# Altium schematic sheet UP-Buzzer-Schematic.SchDoc
size A
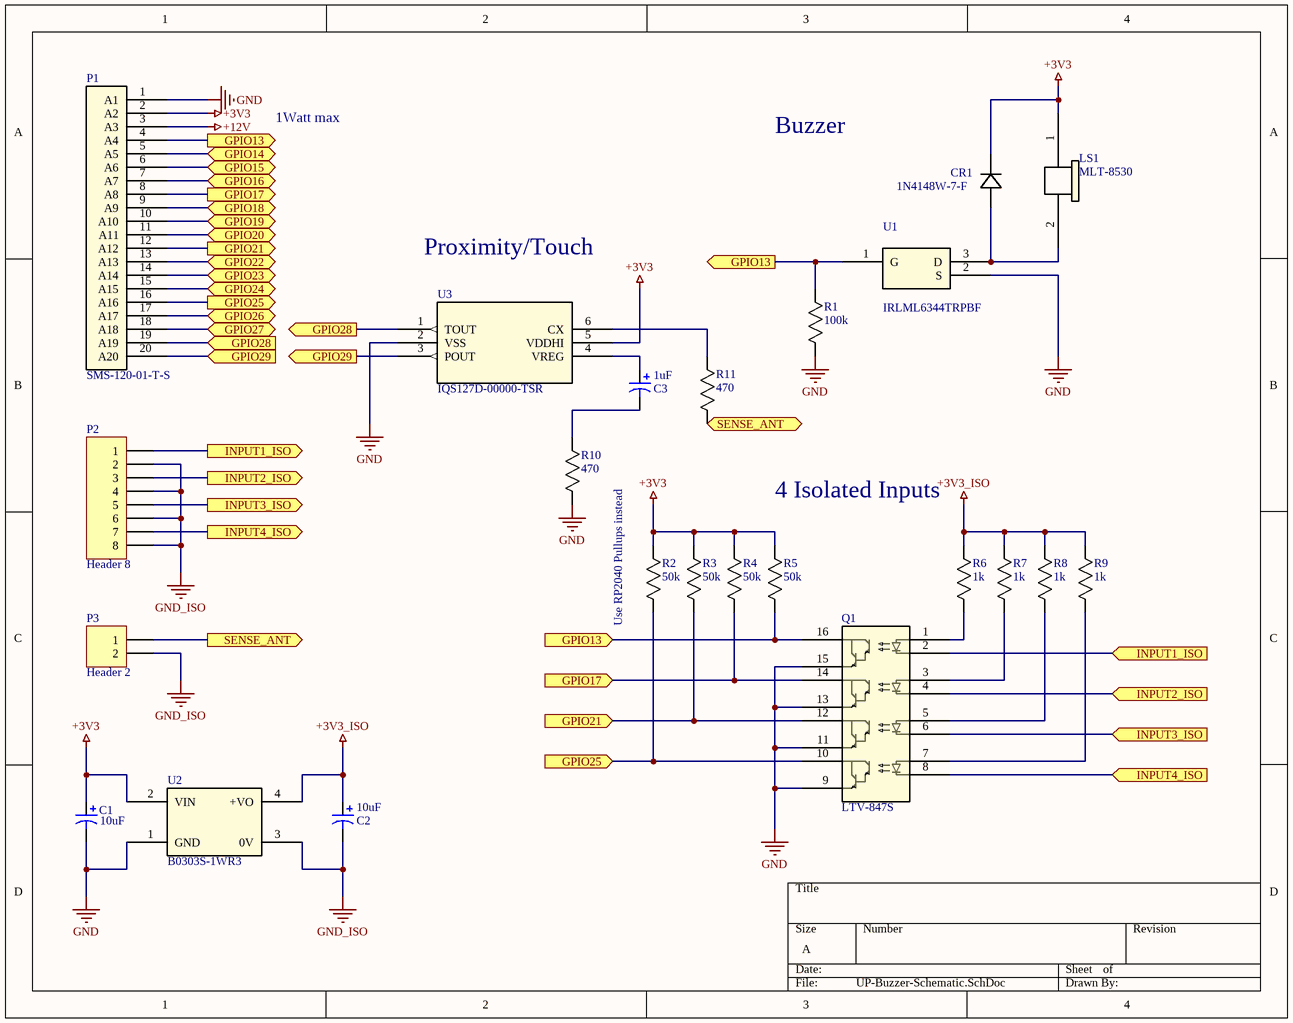
[diagram p0: UP-Buzzer-Schematic.SchDoc]

## Parts
C1  value 10uF  [C0805]
C2  value 10uF  [C0805]  (hidden comment: Cap Pol3)
C3  value 1uF  [C0805]  (hidden comment: Cap Pol3)
CR1  1N4148W-7-F  [SOD123_DIO]
LS1  MLT-8530  [MLT-8530_JHE]
P1  SMS-120-01-T-S  [SMS-S-120]
P2  Header 8  [HDR1X8]
P3  Header 2  [HDR1X2]
Q1  LTV-847S  [LTV-847S_LTO]
R1  100k  [RC0603N_YAG]
R2  50k  [RC0603N_YAG]
R3  50k  [RC0603N_YAG]
R4  50k  [RC0603N_YAG]
R5  50k  [RC0603N_YAG]
R6  1k  [RC0603N_YAG]
R7  1k  [RC0603N_YAG]
R8  1k  [RC0603N_YAG]
R9  1k  [RC0603N_YAG]
R10  470  [RC0603N_YAG]
R11  470  [RC0603N_YAG]
U1  IRLML6344TRPBF  [IRLML6344TRPBF_INF]
U2  B0303S-1WR3  [SIP4_B_S-1WR3_MNS]
U3  IQS127D-00000-TSR  [TSOT23-6_AZQ]

## Ports
GPIO13 (in), GPIO13 (out), GPIO14 (bidir), GPIO15, GPIO16, GPIO17 (in), GPIO17 (out), GPIO18, GPIO19, GPIO20, GPIO21 (in), GPIO21 (out), GPIO22, GPIO23, GPIO24, GPIO25 (in), GPIO25 (out), GPIO26 (bidir), GPIO27 (bidir), GPIO28 (in), GPIO28 (out), GPIO29 (in), GPIO29 (out), INPUT1_ISO (in), INPUT1_ISO (out), INPUT2_ISO (in), INPUT2_ISO (out), INPUT3_ISO (in), INPUT3_ISO (out), INPUT4_ISO (in), INPUT4_ISO (out), SENSE_ANT (in), SENSE_ANT (out)

## Nets
+3V3: C1.1 CR1.1 LS1.1 P1.2(A2) R2.2 R3.2 R4.2 R5.2 U2.2(VIN) U3.5(VDDHI)
+3V3_ISO: C2.1 R6.2 R7.2 R8.2 R9.2 U2.4(+VO)
+12V: P1.3(A3)
GND: C1.2 P1.1(A1) Q1.9 Q1.11 Q1.13 Q1.15 R1.1 R10.1 U1.2(S) U2.1(GND) U3.2(VSS)
GND_ISO: C2.2 P2.2 P2.4 P2.6 P2.8 P3.2 U2.3(0V)
GPIO13: P1.4(A4) Q1.16 R1.2 R5.1 U1.1(G) ; port GPIO13
GPIO14: P1.5(A5) ; port GPIO14
GPIO15: P1.6(A6) ; port GPIO15
GPIO16: P1.7(A7) ; port GPIO16
GPIO17: P1.8(A8) Q1.14 R4.1 ; port GPIO17
GPIO18: P1.9(A9) ; port GPIO18
GPIO19: P1.10(A10) ; port GPIO19
GPIO20: P1.11(A11) ; port GPIO20
GPIO21: P1.12(A12) Q1.12 R3.1 ; port GPIO21
GPIO22: P1.13(A13) ; port GPIO22
GPIO23: P1.14(A14) ; port GPIO23
GPIO24: P1.15(A15) ; port GPIO24
GPIO25: P1.16(A16) Q1.10 R2.1 ; port GPIO25
GPIO26: P1.17(A17) ; port GPIO26
GPIO27: P1.18(A18) ; port GPIO27
GPIO28: P1.19(A19) U3.1(TOUT) ; port GPIO28
GPIO29: P1.20(A20) U3.3(POUT) ; port GPIO29
INPUT1_ISO: P2.1 Q1.2 ; port INPUT1_ISO
INPUT2_ISO: P2.3 Q1.4 ; port INPUT2_ISO
INPUT3_ISO: P2.5 Q1.6 ; port INPUT3_ISO
INPUT4_ISO: P2.7 Q1.8 ; port INPUT4_ISO
SENSE_ANT: P3.1 R11.1 ; port SENSE_ANT
NetC3_1: C3.1 U3.4(VREG)
NetC3_2: C3.2 R10.2
NetCR1_2: CR1.2 LS1.2 U1.3(D)
NetQ1_1: Q1.1 R6.1
NetQ1_3: Q1.3 R7.1
NetQ1_5: Q1.5 R8.1
NetQ1_7: Q1.7 R9.1
NetR11_2: R11.2 U3.6(CX)

## Notes on the sheet
- 1Watt max
- Buzzer
- Proximity/Touch
- 4 Isolated Inputs
- Use RP2040 Pullups instead

## Library data of the parts
C1-C3 = Cap Pol3: Polarized Capacitor (Surface Mount); Published: 8-Jun-2000; LatestRevisionDate: 29-May-2009; LatestRevisionNote: IPC-7351 Footprint Added.; PackageReference: C0805; Publisher: Altium Limited; PackageDescription: Chip Capacitor
CR1 = 1N4148W-7-F: No Description Available; Mfr_Name: Diodes Inc
LS1 = MLT-8530: No Description Available; Mfr_Name: Jiangsu Huaneng Elec; RefDes: RefDes; Type: Type
P1 = SMS-120-01-T-S: No Description Available; Mfr_Name: Samtec Inc; RefDes: RefDes; Type: Type
P2 = Header 8: Header, 8-Pin; LatestRevisionDate: 17-Jul-2002; LatestRevisionNote: Re-released for DXP Platform.; Publisher: Altium Limited
P3 = Header 2: Header, 2-Pin; LatestRevisionDate: 17-Jul-2002; LatestRevisionNote: Re-released for DXP Platform.; Publisher: Altium Limited
Q1 = LTV-847S: No Description Available; Mfr_Name: LITE-ON; RefDes: RefDes; Type: Type
R1-R11 = RC0603FR-07470RL: No Description Available; Mfr_Name: Yageo
U1 = IRLML6344TRPBF: No Description Available; Mfr_Name: Infineon; RefDes: RefDes; Type: Type
U2 = B0303S-1WR3: No Description Available; Mfr_Name: MORNSUN; Type: DC DC Converters; RefDes: RefDes
U3 = IQS127D-00000-TSR: No Description Available; Mfr_Name: Azoteq; RefDes: RefDes; Type: Type